# EAGLE design versao2 (EAGLE 9.6.2)
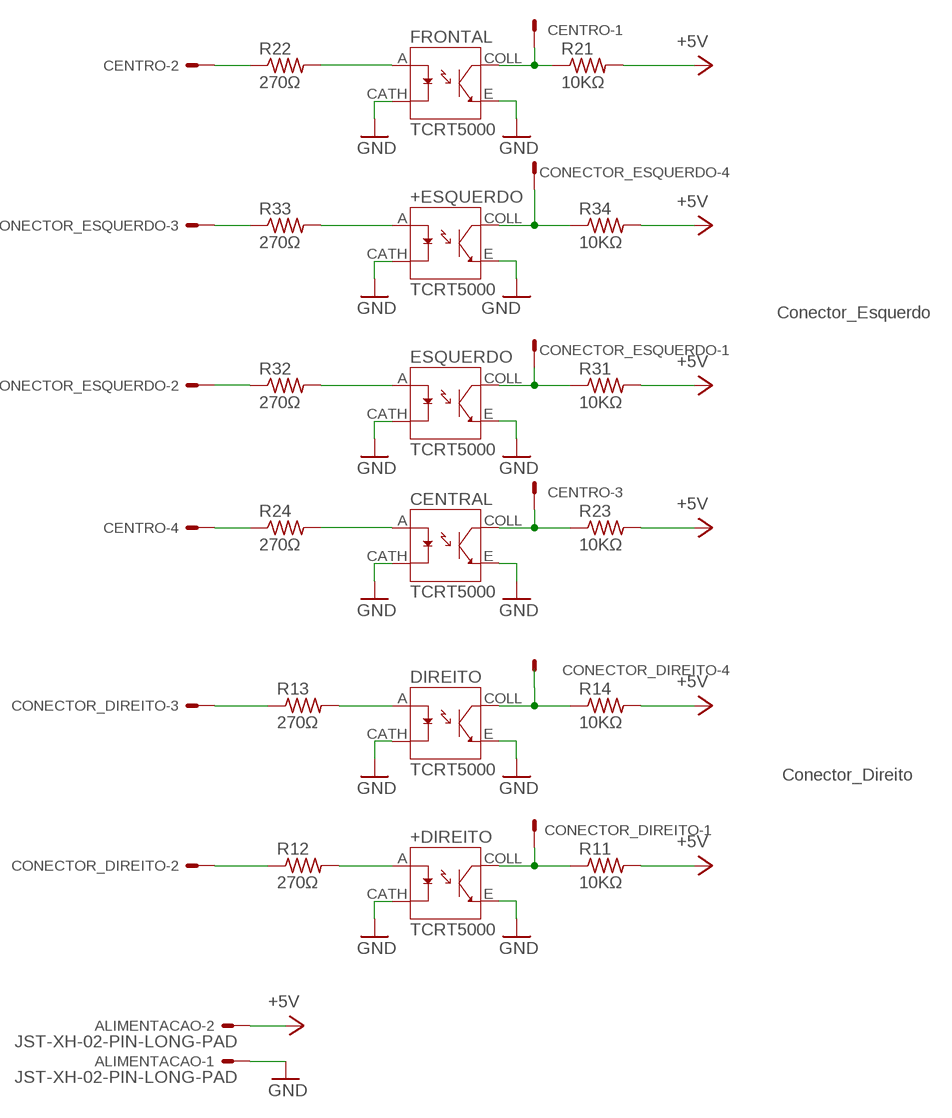
[diagram p0: schematic, sheet 1]

## Parts
+DIREITO  TCRT5000  [OPTO_TCRT5000]
+ESQUERDO  TCRT5000  [OPTO_TCRT5000]
ALIMENTACAO  JST-XH-02-PIN-LONG-PAD  [JST-XH-02-PACKAGE-LONG-PAD]
CENTRAL  TCRT5000  [OPTO_TCRT5000]
CENTRO  JST-XH-04-PIN-LONG-PAD  [JST-XH-04-PACKAGE-LONG-PAD]
CONECTOR_DIREITO  Conector_Direito  JST-XH-04-PIN-LONG-PAD  [JST-XH-04-PACKAGE-LONG-PAD]
CONECTOR_ESQUERDO  Conector_Esquerdo  JST-XH-04-PIN-LONG-PAD  [JST-XH-04-PACKAGE-LONG-PAD]
DIREITO  TCRT5000  [OPTO_TCRT5000]
ESQUERDO  TCRT5000  [OPTO_TCRT5000]
FRONTAL  TCRT5000  [OPTO_TCRT5000]
R11  10KΩ  R-US_0204/7  [0204/7]
R12  270Ω  R-US_0204/7  [0204/7]
R13  270Ω  R-US_0204/7  [0204/7]
R14  10KΩ  R-US_0204/7  [0204/7]
R21  10KΩ  R-US_0204/7  [0204/7]
R22  270Ω  R-US_0204/7  [0204/7]
R23  10KΩ  R-US_0204/7  [0204/7]
R24  270Ω  R-US_0204/7  [0204/7]
R31  10KΩ  R-US_0204/7  [0204/7]
R32  270Ω  R-US_0204/7  [0204/7]
R33  270Ω  R-US_0204/7  [0204/7]
R34  10KΩ  R-US_0204/7  [0204/7]

## Nets
+5V: ALIMENTACAO.2 R11.2 R14.2 R21.2 R23.2 R31.2 R34.2
ANALOG+ESQ: +ESQUERDO.COLL CONECTOR_ESQUERDO.4 R34.1
ANALOG_+DI: +DIREITO.COLL CONECTOR_DIREITO.1 R11.1
ANALOG_CE: CENTRAL.COLL CENTRO.3 R23.1
ANALOG_DI: CONECTOR_DIREITO.4 DIREITO.COLL R14.1
ANALOG_ESQ: CONECTOR_ESQUERDO.1 ESQUERDO.COLL R31.1
ANALOG_FR: CENTRO.1 FRONTAL.COLL R21.1
CENTRAL: CENTRAL.A R24.2
DIGITA+ESQ: +ESQUERDO.A R33.2
DIGITAL: ESQUERDO.A R32.2
DIGITAL+DIR: +DIREITO.A R12.2
DIGITAL+ESQ: CONECTOR_ESQUERDO.3 R33.1
DIGITAL_+DI: CONECTOR_DIREITO.2 R12.1
DIGITAL_CE: CENTRO.4 R24.1
DIGITAL_DI: CONECTOR_DIREITO.3 R13.1
DIGITAL_ESQ: CONECTOR_ESQUERDO.2 R32.1
DIGITAL_FR: FRONTAL.A R22.2
DIGTAL-DI: DIREITO.A R13.2
FRONTAL: CENTRO.2 R22.1
GND: +DIREITO.CATH +DIREITO.E +ESQUERDO.CATH +ESQUERDO.E ALIMENTACAO.1 CENTRAL.CATH CENTRAL.E DIREITO.CATH DIREITO.E ESQUERDO.CATH ESQUERDO.E FRONTAL.CATH FRONTAL.E

## Library data of the parts
+DIREITO +ESQUERDO CENTRAL DIREITO ESQUERDO FRONTAL = TCRT5000:TCRT5000: 950 nm 60 mA Through Hole Reflective Optical Sensor with Transistor Output Check availability <https://pricing.snapeda.com/parts/TCRT5000/Vishay/view-part?ref=eda>; AVAILABILITY: In Stock; DESCRIPTION: Reflective Optical Sensor 0.591 (15mm) PCB Mount; MF: Vishay; MP: TCRT5000; PACKAGE: TCRT5000 Vishay; PRICE: None; PURCHASE-URL: https://pricing.snapeda.com/search?q=TCRT5000&ref=eda
ALIMENTACAO = Rembrandt Electronics - JST XH Connectors v1-0:JST-XH-02-PIN: JST XH Connector 2 Pin Wire to board connector. Pitch: 2,54 mm, (0.100") Number of pins: 2 Created by Rembrandt Electronics www.rembrandtelectronics.com
CENTRO CONECTOR_DIREITO CONECTOR_ESQUERDO = Rembrandt Electronics - JST XH Connectors v1-0:JST-XH-04-PIN: JST XH Connector 2 Pin Wire to board connector. Pitch: 2,54 mm, (0.100") Number of pins: 4 Created by Rembrandt Electronics www.rembrandtelectronics.com
R11-R14 R21-R24 R31-R34 = rcl_robotica:R-US_: RESISTOR, American symbol; SPICEPREFIX: R

## Board
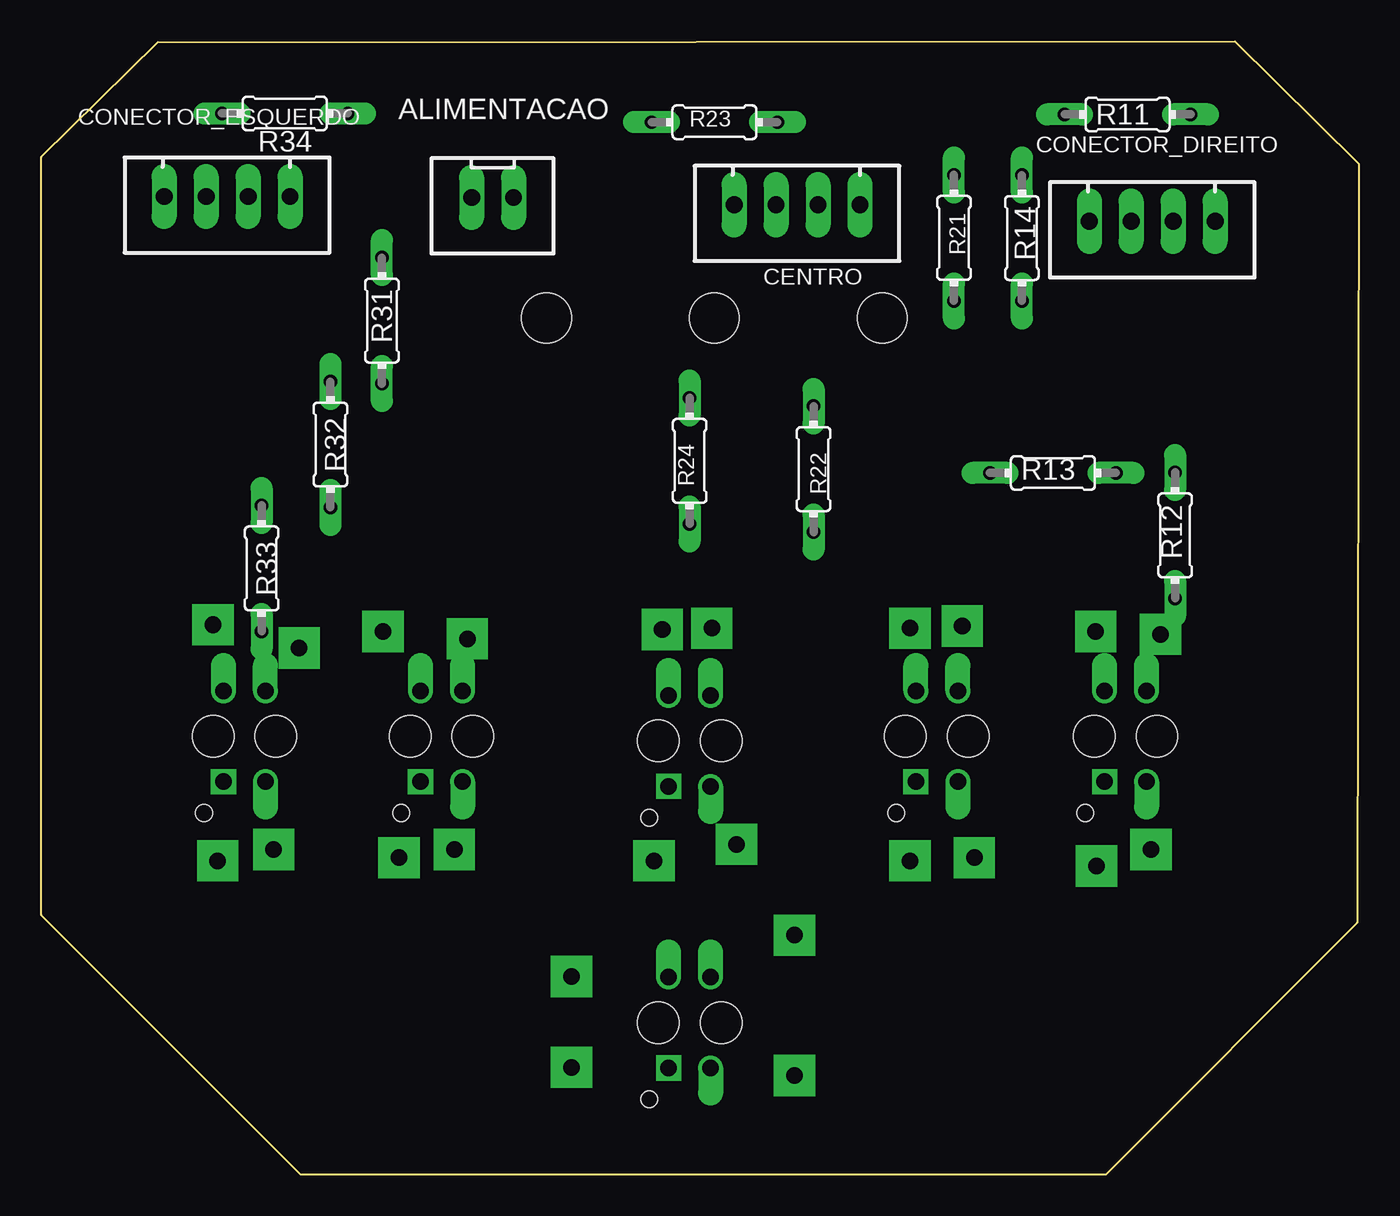
[diagram p1: board, top side]
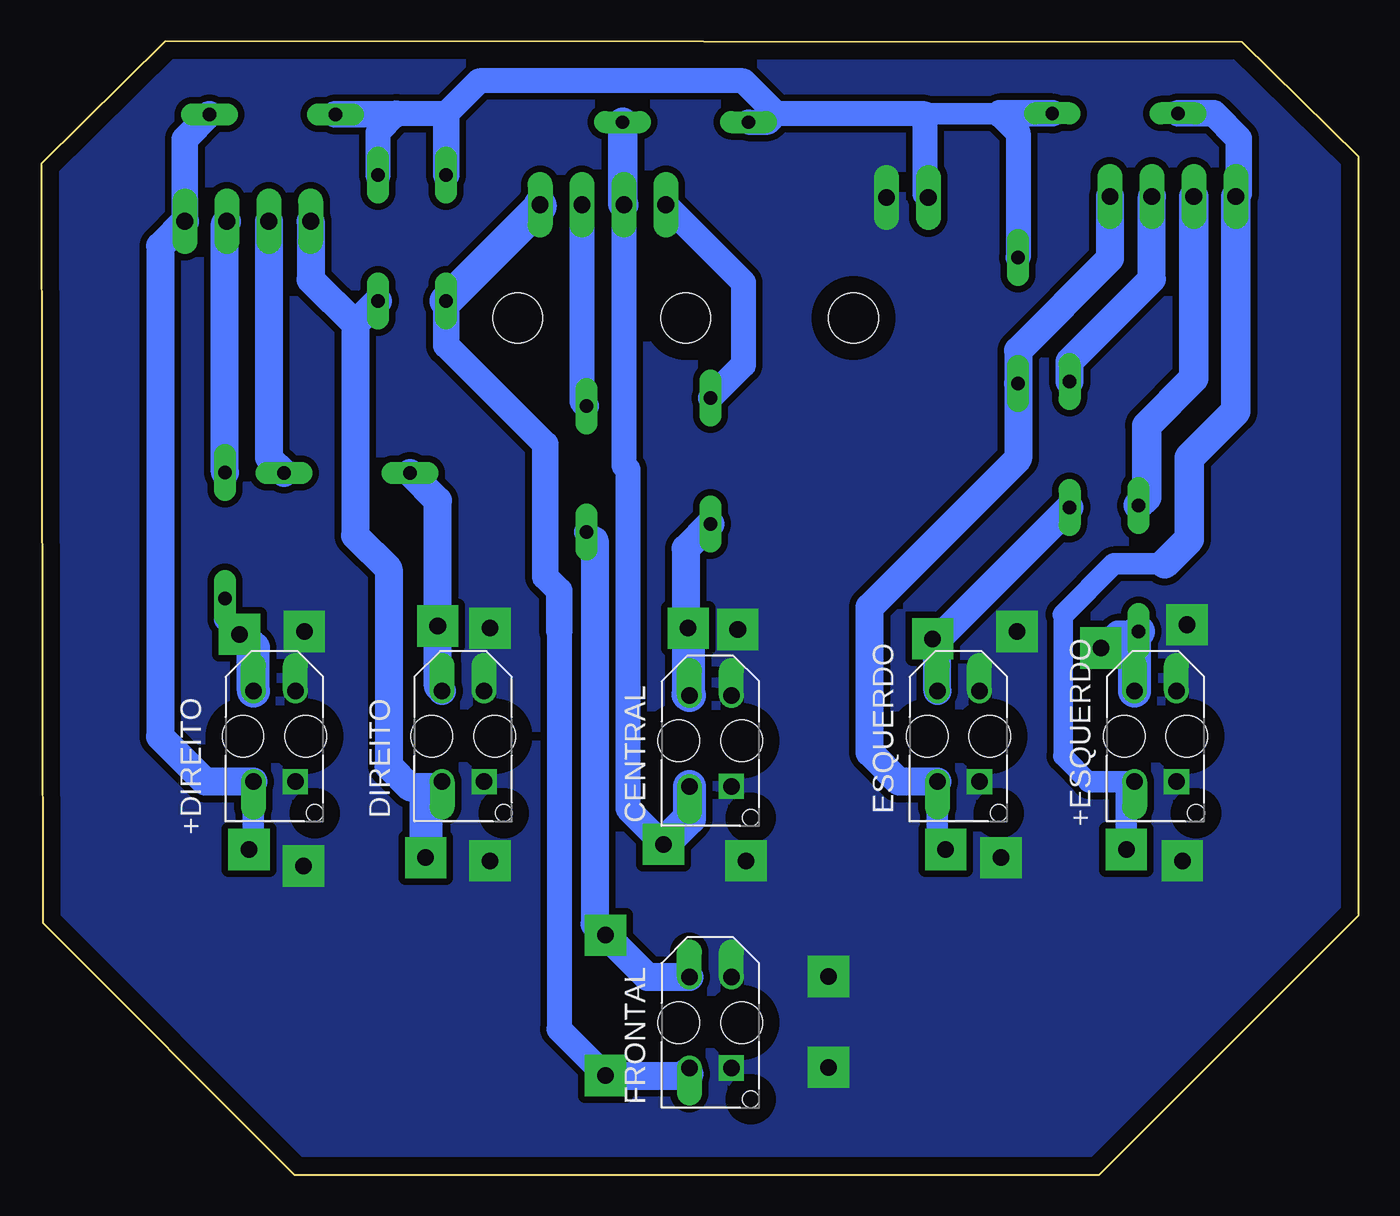
[diagram p2: board, bottom side, seen from below]

Size 79.75 x 68.6 mm. Coordinates in mm from the lower left corner, seen from the top.
Outline: 7.05,68.55 72.25,68.6 79.75,61.2 79.65,15.25 64.45,0 15.7,0 0,15.7 0,61.6 7.05,68.55
Copper layers (1*16): Top 0.035mm / dielectric 1.5mm / Bottom 0.035mm
Design rules "default *": minimum track width 6mil, minimum drill 0.35mm, track to track 16mil, track to pad 16mil, pad to pad 16mil, via to via 16mil, smd to smd 6mil, copper to edge 40mil, drill to drill 6mil, minimum pad ring 10mil, minimum via ring 8mil, stop-mask expansion 4mil, vias tented up to drill 0mil, thermal gap 0mil
Holes 3 mm at 30.58,51.85 50.9,51.85 40.74,51.85

### Footprints (pad centres in the part's own frame; a part is rotated, then mirrored left to right if it is on the bottom)
OPTO_TCRT5000 = drill 1 pad 1.524 offset: A 2.75,1.27; CATH 2.75,-1.27; COLL -2.75,1.27 | drill 1 pad 1.524 square: E -2.75,-1.27 | hole 1: -4.65,-2.45 | hole 2.5: 0,-1.9; 0,1.9
JST-XH-02-PACKAGE-LONG-PAD = drill 1.016 long: 1 -1.27,0; 2 1.27,0
JST-XH-04-PACKAGE-LONG-PAD = drill 1.016 long: 1 -3.81,0; 2 -1.27,0; 3 1.27,0; 4 3.81,0
0204/7 = drill 0.813 long: 1 -3.81,0; 2 3.81,0

### Placement (x,y rotation side)
+DIREITO  65.64,26.53 90 bottom
+ESQUERDO  12.3,26.53 90 bottom
ALIMENTACAO  27.32,59.15 180 top
CENTRAL  39.25,26.25 90 bottom
CENTRO  45.75,58.7 180 top
CONECTOR_DIREITO  67.25,57.7 180 top
CONECTOR_ESQUERDO  11.25,59.2 180 top
DIREITO  54.21,26.53 90 bottom
ESQUERDO  24.23,26.53 90 bottom
FRONTAL  39.25,9.2 90 bottom
R11  65.76,64.17 180 top
R12  68.64,38.69 270 top
R13  61.24,42.47 180 top
R14  59.36,56.69 90 top
R21  55.25,56.7 90 top
R22  46.75,42.7 270 top
R23  40.75,63.7 180 top
R24  39.25,43.2 270 top
R31  20.62,51.69 90 top
R32  17.5,44.19 270 top
R33  13.34,36.69 270 top
R34  14.74,64.23 0 top

### Tracks (layer width: path | path; a pad name or v marks a point on that pad's centre or on a via)
+5V
  Bottom 1.3: 21.75,64.2 26.25,64.2
  Bottom 1.5: ALIMENTACAO.2 26.25,59.35 26.25,64.2 35.25,64.2 | 21.75,64.2 20.62,63.07 R31.2 | R14.2 59.36,63.09 58.25,64.2 55.25,64.2 53.25,66.2 37.25,66.2 35.25,64.2 | R23.2 35.75,63.7 35.25,64.2
  Bottom 1.6: R34.2 21.72,64.23 21.75,64.2 | R11.2 58.28,64.17 58.25,64.2 | R21.2 55.25,64.2
ANALOG+ESQ  (via drill 1 pad 2.5)
  Bottom 1.18: 17.9,33.9 17.9,25.35
  Bottom 1.2: 17.9,25.35 16.33,23.78
  Bottom 1.3: 11.75,36.97 14.83,36.97 17.9,33.9 | v14.07,19.68 14.07,23.28 +ESQUERDO.COLL 16.33,23.78
  Bottom 1.6: R34.1 8.78,64.23 7.25,62.7 7.25,59.39 CONECTOR_ESQUERDO.4
  Bottom 1.8: CONECTOR_ESQUERDO.4 7.44,46.2 10.25,43.39 10.25,38.47 11.75,36.97
ANALOG_+DI  (via drill 1 pad 2.5)
  Bottom 1.3: +DIREITO.COLL 66.91,19.68 v67.18,19.68
  Bottom 1.6: R11.1 71.06,62.68 CONECTOR_DIREITO.1
  Bottom 1.7: CONECTOR_DIREITO.1 72.56,56.2 72.56,26.51 69.83,23.78 +DIREITO.COLL
ANALOG_CE  (via drill 1 pad 2.5)
  Bottom 1.5: v42.09,19.99 44.24,22.14 44.24,42.69 44.48,42.93 CENTRO.3
  Bottom 1.8: R23.1 44.56,58.78 CENTRO.3
  Bottom 2: CENTRAL.COLL 40.52,21.56 v42.09,19.99
ANALOG_DI  (via drill 1 pad 2.5)
  Bottom 1.016: 57.26,23.76 57.23,23.78 DIREITO.COLL 55.91,23.36 56.48,22.78
  Bottom 1.7: 60.75,51.49 R14.1 | 60.75,51.49 60.75,38.68 58.73,36.66 58.73,24.74 57.4,23.41 55.96,23.41 55.91,23.36 | CONECTOR_DIREITO.4 63.44,54.18 60.75,51.49
  Bottom 2: 56.48,22.78 v56.48,19.18
ANALOG_ESQ  (via drill 1 pad 2.5)
  Bottom 1.3: ESQUERDO.COLL 25.5,20.18 v25,19.68
  Bottom 1.7: CONECTOR_ESQUERDO.1 15.06,55.44 20.62,49.88 R31.1 20.62,43.33 29.61,34.34 29.61,25.56 27.83,23.78 ESQUERDO.COLL
ANALOG_FR  (via drill 1 pad 2.5)
  Bottom 1.27: FRONTAL.COLL 40.52,6.16
  Bottom 1.5: 48.4,32.93 48.4,8.8 v45.59,5.99
  Bottom 1.54: 40.52,6.08 40.52,6.16
  Bottom 1.6: 48.4,32.93 48.4,35.35 49.25,36.2 49.25,44.2 55.25,50.2 R21.1
  Bottom 1.7: v45.59,5.99 40.98,5.99 40.89,6.08 40.52,6.08
  Bottom 2: CENTRO.1 49.56,58.58 R21.1
CENTRAL  (via drill 1 pad 2.5)
  Bottom 1.7: R24.2 40.75,37.89 40.75,33.23 v40.59,33.07
  Bottom 2: CENTRAL.A 40.59,29.07 v40.59,33.07
DIGITA+ESQ  (via drill 1 pad 2.5)
  Bottom 1.3: R33.2 14.61,32.88 v15.61,31.88
  Bottom 2: +ESQUERDO.A 13.57,32.65 R33.2
DIGITAL  (via drill 1 pad 2.5)
  Bottom 1.7: R32.2 25.45,32.43 | 25.45,32.43 25.5,32.38 ESQUERDO.A | 25.45,32.43 v25.79,32.43
DIGITAL+DIR  (via drill 1 pad 2.5)
  Bottom 1.3: R12.2 68.64,33.59 v67.75,32.7
  Bottom 2: +DIREITO.A 66.91,31.86 v67.75,32.7
DIGITAL+ESQ
  Bottom 1.8: CONECTOR_ESQUERDO.3 9.98,48.2 12.84,45.34 12.84,41 R33.1
DIGITAL_+DI
  Bottom 1.7: R12.1 68.64,57.58 CONECTOR_DIREITO.2
DIGITAL_CE
  Bottom 1.5: CENTRO.4 37.25,54.01 37.25,49.01 R24.1
DIGITAL_DI
  Bottom 1.7: CONECTOR_DIREITO.3 65.98,43.4 R13.1
DIGITAL_ESQ
  Bottom 1.7: R32.1 17.5,49.22 12.52,54.2 CONECTOR_ESQUERDO.2
DIGITAL_FR  (via drill 1 pad 2.5)
  Bottom 1.5: R22.2 46.25,38.39
  Bottom 1.7: 46.25,38.39 46.25,15.15 v45.59,14.49 43.05,11.95 FRONTAL.A
DIGTAL-DI  (via drill 1 pad 2.5)
  Bottom 1.7: DIREITO.A 55.75,29.55 v55.75,33.2 55.75,40.79 R13.2
FRONTAL
  Bottom 1.5: CENTRO.2 47.02,46.78 R22.1
GND  (via drill 1 pad 2.5)
  other vias: 10.68,18.99 10.39,33.28 21.65,19.18 20.69,32.88 52.59,33.07 52.59,18.99 63.87,18.68 63.83,32.88 37.59,32.99 37.09,18.99 32.09,11.99 32.09,6.49
  pour Bottom: -7.47,-3.02 -6.55,-3.94 80.22,-3.94 88.07,3.91 88.07,64.39 77.03,75.43 -6.05,75.43